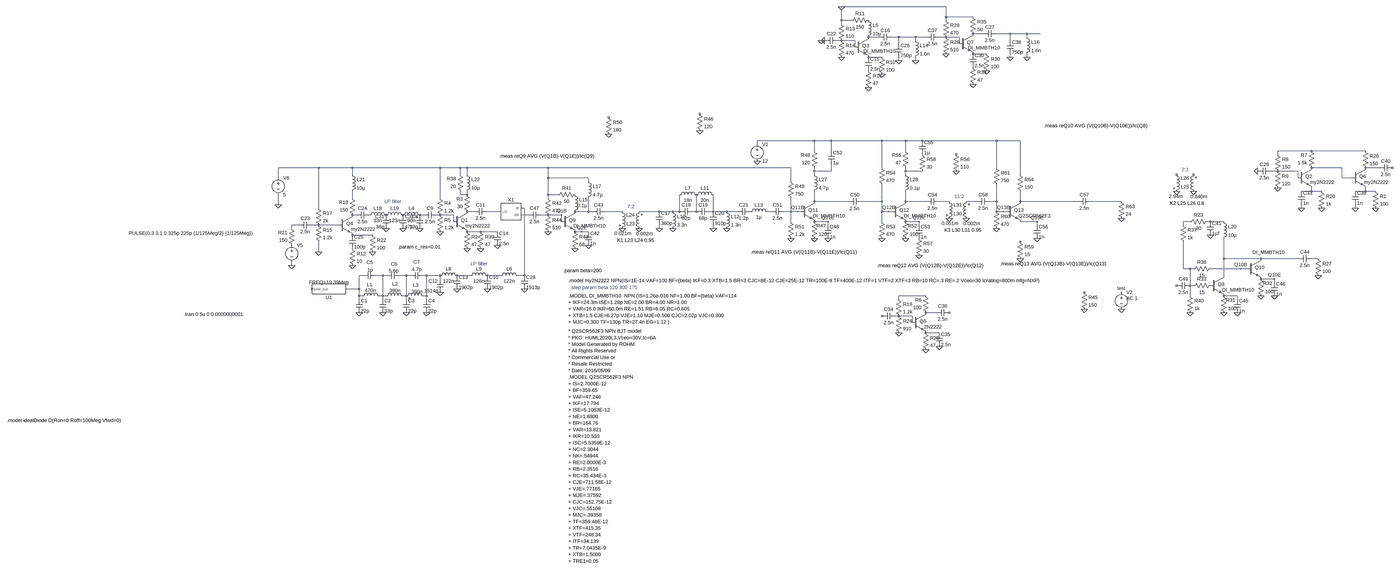
[diagram p0: schematic Draft1_old.asc, whole sheet]
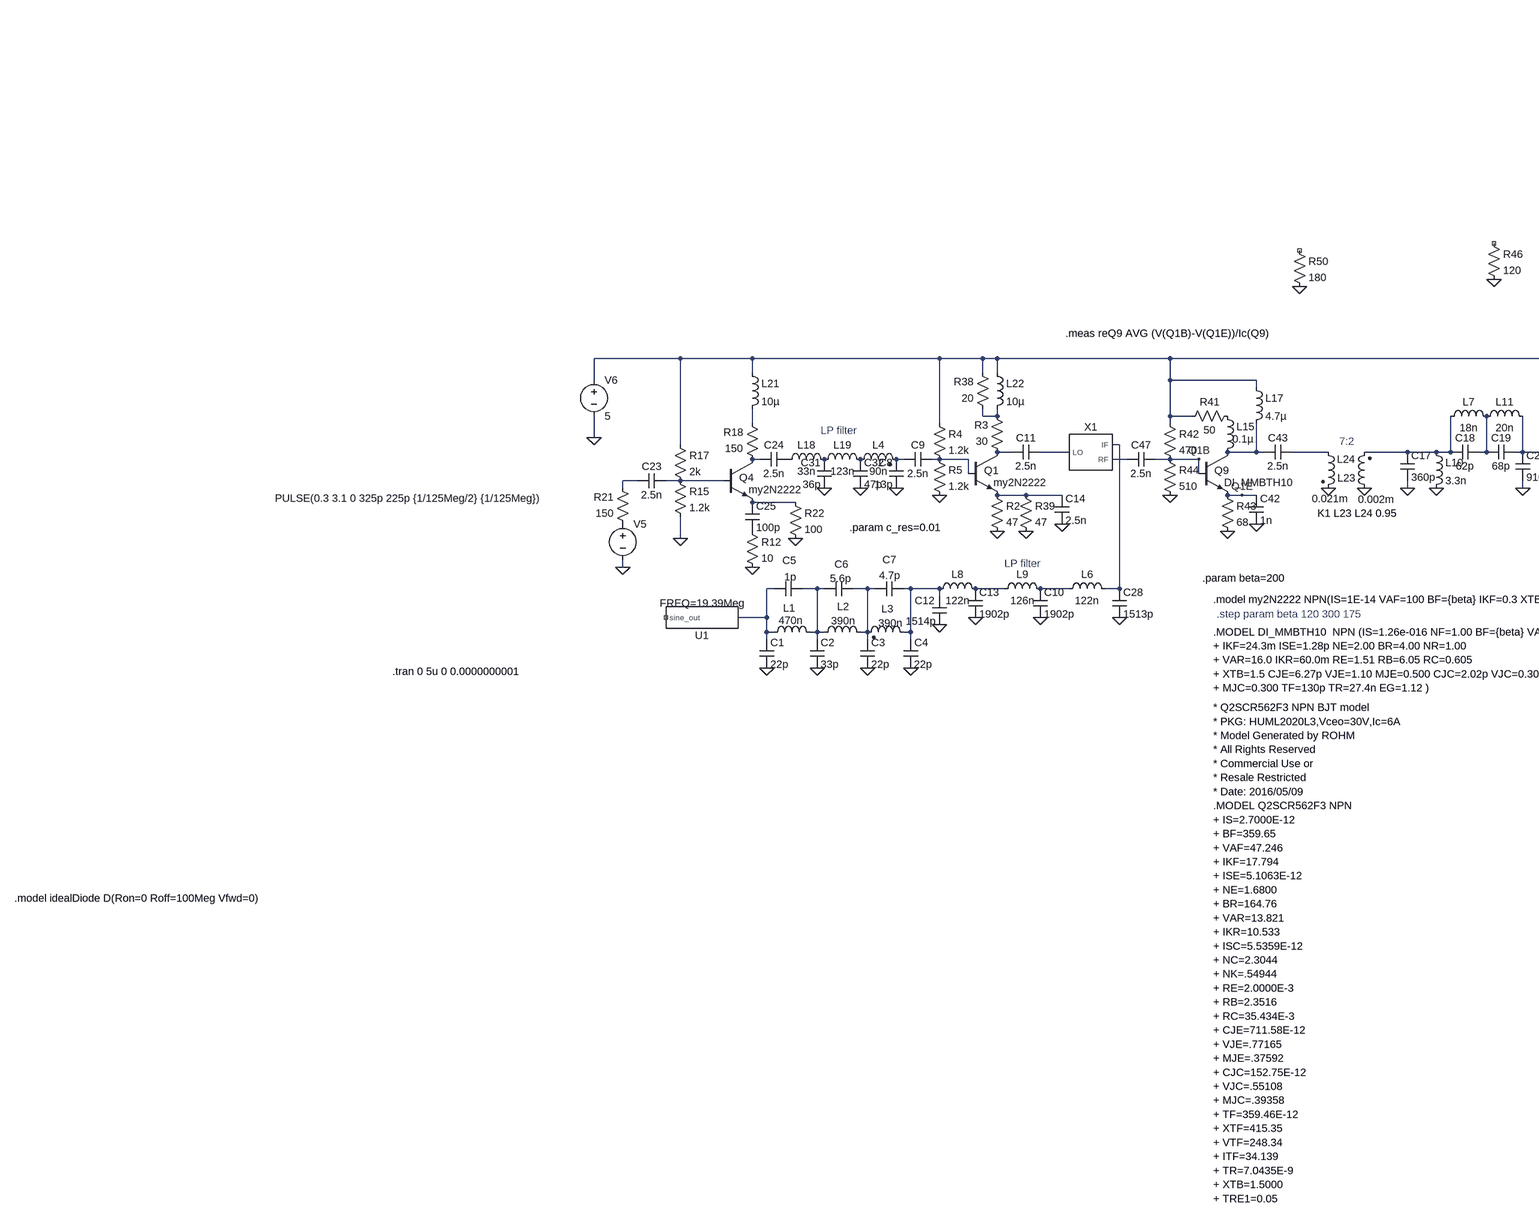
[diagram p1: schematic Draft1_old.asc, part, row 1 of 1, column 1 of 2]
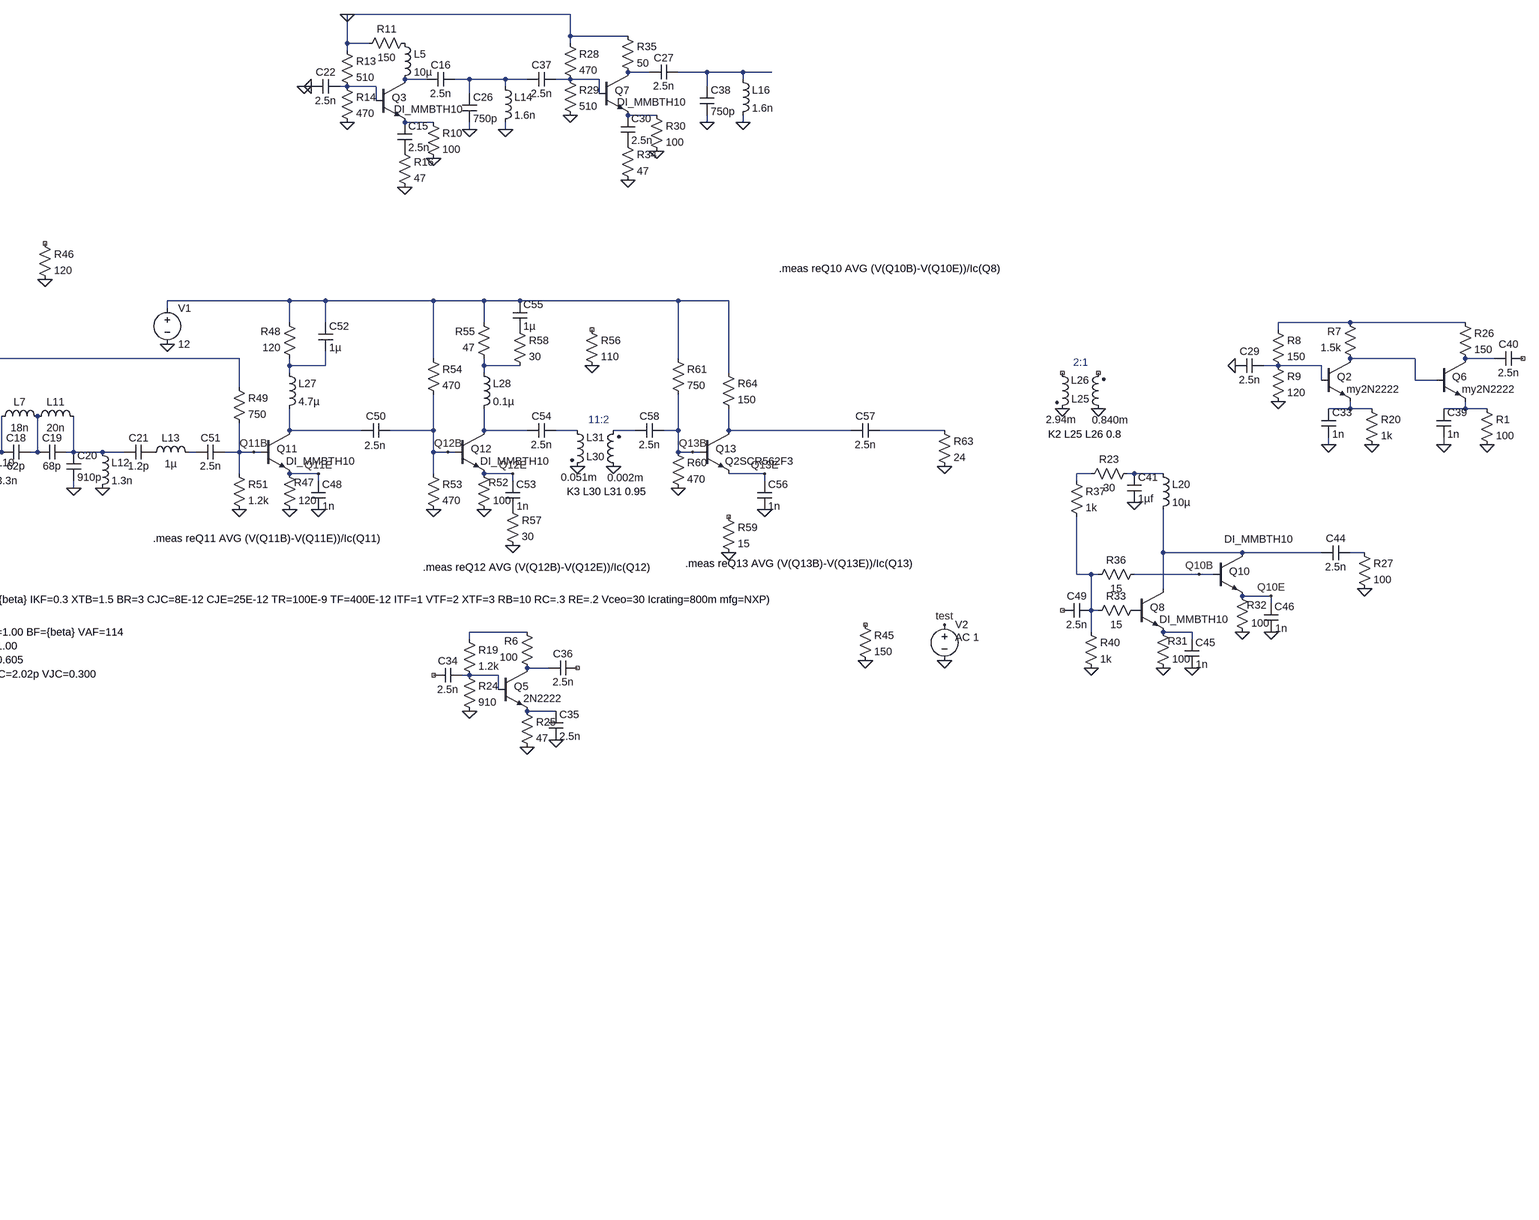
[diagram p2: schematic Draft1_old.asc, part, row 1 of 1, column 2 of 2]
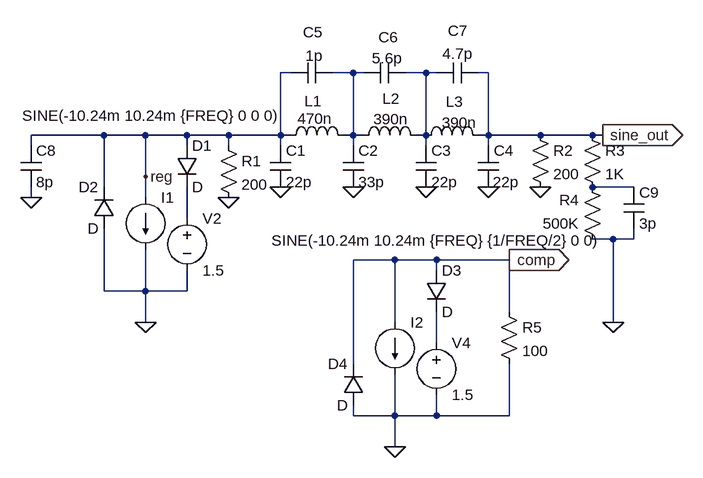
[diagram p3: sub-circuit ad9850.asc]
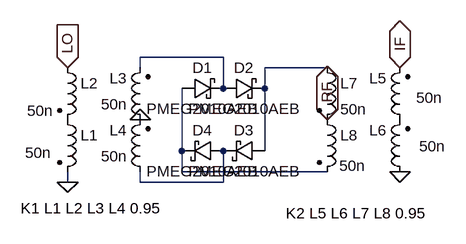
[diagram p4: sub-circuit mixer.asc]
Draft1_old.asc, the LTspice schematic file:
Version 4
SHEET 1 5384 1444
WIRE 3008 -1312 2512 -1312
WIRE 3008 -1264 3008 -1312
WIRE 3136 -1264 3008 -1264
WIRE 2512 -1248 2512 -1312
WIRE 2560 -1248 2512 -1248
WIRE 3008 -1248 3008 -1264
WIRE 2512 -1232 2512 -1248
WIRE 3184 -1184 3136 -1184
WIRE 3312 -1184 3248 -1184
WIRE 3392 -1184 3312 -1184
WIRE 3456 -1184 3392 -1184
WIRE 2688 -1168 2640 -1168
WIRE 2784 -1168 2752 -1168
WIRE 2864 -1168 2784 -1168
WIRE 2912 -1168 2864 -1168
WIRE 3008 -1168 2976 -1168
WIRE 3072 -1168 3008 -1168
WIRE 3392 -1168 3392 -1184
WIRE 2512 -1152 2496 -1152
WIRE 2576 -1152 2512 -1152
WIRE 2864 -1152 2864 -1168
WIRE 3312 -1152 3312 -1184
WIRE 2784 -1136 2784 -1168
WIRE 3072 -1136 3072 -1168
WIRE 2576 -1120 2576 -1152
WIRE 3200 -1088 3136 -1088
WIRE 2704 -1072 2640 -1072
WIRE 3312 -1072 3312 -1088
WIRE 3392 -1072 3392 -1088
WIRE 2784 -1056 2784 -1072
WIRE 2864 -1056 2864 -1072
WIRE 2384 -640 2112 -640
WIRE 2464 -640 2384 -640
WIRE 2704 -640 2464 -640
WIRE 2816 -640 2704 -640
WIRE 2896 -640 2816 -640
WIRE 3248 -640 2896 -640
WIRE 3360 -640 3248 -640
WIRE 2112 -624 2112 -640
WIRE 2384 -592 2384 -640
WIRE 2464 -592 2464 -640
WIRE 2816 -592 2816 -640
WIRE 4992 -592 4832 -592
WIRE 5248 -592 4992 -592
WIRE 4832 -576 4832 -592
WIRE 32 -512 -160 -512
WIRE 192 -512 32 -512
WIRE 608 -512 192 -512
WIRE 704 -512 608 -512
WIRE 736 -512 704 -512
WIRE 1120 -512 736 -512
WIRE 2272 -512 1120 -512
WIRE 2704 -512 2704 -640
WIRE 3248 -512 3248 -640
WIRE 5136 -512 4992 -512
WIRE 5312 -512 5248 -512
WIRE 2384 -496 2384 -512
WIRE 2464 -496 2464 -528
WIRE 2464 -496 2384 -496
WIRE 2816 -496 2816 -512
WIRE 2896 -496 2816 -496
WIRE 4832 -496 4800 -496
WIRE 4928 -496 4832 -496
WIRE 192 -480 192 -512
WIRE 704 -480 704 -512
WIRE 736 -480 736 -512
WIRE 2384 -480 2384 -496
WIRE 2816 -480 2816 -496
WIRE 3360 -480 3360 -640
WIRE -160 -464 -160 -512
WIRE 1120 -464 1120 -512
WIRE 1312 -464 1120 -464
WIRE 4928 -464 4928 -496
WIRE 5136 -464 5136 -512
WIRE 5184 -464 5136 -464
WIRE 1312 -448 1312 -464
WIRE 2272 -448 2272 -512
WIRE 4992 -400 4992 -416
WIRE 4992 -400 4944 -400
WIRE 5040 -400 4992 -400
WIRE 5248 -400 5248 -416
WIRE 5248 -400 5200 -400
WIRE 5296 -400 5248 -400
WIRE 704 -384 704 -400
WIRE 736 -384 736 -400
WIRE 736 -384 704 -384
WIRE 1120 -384 1120 -464
WIRE 1168 -384 1120 -384
WIRE 192 -368 192 -400
WIRE 608 -368 608 -512
WIRE 1120 -368 1120 -384
WIRE 2384 -352 2384 -400
WIRE 2544 -352 2384 -352
WIRE 2704 -352 2704 -432
WIRE 2704 -352 2608 -352
WIRE 2816 -352 2816 -400
WIRE 2912 -352 2816 -352
WIRE 3024 -352 2976 -352
WIRE 3152 -352 3104 -352
WIRE 3248 -352 3248 -432
WIRE 3248 -352 3216 -352
WIRE 3360 -352 3360 -400
WIRE 3632 -352 3360 -352
WIRE 3840 -352 3696 -352
WIRE -160 -336 -160 -384
WIRE 32 -320 32 -512
WIRE 1008 -320 992 -320
WIRE 4944 -320 4944 -336
WIRE 5200 -320 5200 -336
WIRE 768 -304 736 -304
WIRE 896 -304 832 -304
WIRE 1312 -304 1312 -368
WIRE 1312 -304 1248 -304
WIRE 1328 -304 1312 -304
WIRE 1472 -304 1392 -304
WIRE 1648 -304 1552 -304
WIRE 1712 -304 1648 -304
WIRE 1744 -304 1744 -384
WIRE 1744 -304 1712 -304
WIRE 1824 -304 1824 -384
WIRE 1824 -304 1808 -304
WIRE 1904 -304 1904 -384
WIRE 1904 -304 1888 -304
WIRE 1968 -304 1904 -304
WIRE 2016 -304 1968 -304
WIRE 2176 -304 2160 -304
WIRE 2272 -304 2272 -368
WIRE 2272 -304 2240 -304
WIRE 2304 -304 2272 -304
WIRE 2320 -304 2304 -304
WIRE 2704 -304 2704 -352
WIRE 2736 -304 2704 -304
WIRE 2752 -304 2736 -304
WIRE 3248 -304 3248 -352
WIRE 3280 -304 3248 -304
WIRE 3296 -304 3280 -304
WIRE 208 -288 192 -288
WIRE 528 -288 512 -288
WIRE 608 -288 592 -288
WIRE 672 -288 608 -288
WIRE 1024 -288 992 -288
WIRE 1120 -288 1088 -288
WIRE 1184 -288 1120 -288
WIRE 672 -256 672 -288
WIRE 1184 -256 1184 -288
WIRE 2272 -256 2272 -304
WIRE 2448 -256 2384 -256
WIRE 2704 -256 2704 -304
WIRE 2880 -256 2816 -256
WIRE 3440 -256 3360 -256
WIRE 4416 -256 4384 -256
WIRE 4512 -256 4496 -256
WIRE 4576 -256 4512 -256
WIRE -64 -240 -96 -240
WIRE 32 -240 0 -240
WIRE 128 -240 32 -240
WIRE 2448 -240 2448 -256
WIRE 2880 -240 2880 -256
WIRE 3440 -240 3440 -256
WIRE 4384 -240 4384 -256
WIRE -96 -224 -96 -240
WIRE 1648 -224 1648 -240
WIRE 1904 -224 1904 -240
WIRE 800 -208 736 -208
WIRE 880 -208 800 -208
WIRE 1280 -208 1248 -208
WIRE 1312 -208 1280 -208
WIRE 288 -192 192 -192
WIRE 32 -112 32 -160
WIRE 4576 -80 4576 -176
WIRE 4752 -80 4576 -80
WIRE 4928 -80 4752 -80
WIRE 5024 -80 4992 -80
WIRE -96 -48 -96 -64
WIRE 4384 -32 4384 -160
WIRE 4416 -32 4384 -32
WIRE 4432 -32 4416 -32
WIRE 4656 -32 4512 -32
WIRE 4688 -32 4656 -32
WIRE 240 0 224 0
WIRE 336 0 304 0
WIRE 352 0 336 0
WIRE 448 0 416 0
WIRE 464 0 448 0
WIRE 544 0 528 0
WIRE 608 0 544 0
WIRE 752 0 688 0
WIRE 896 0 832 0
WIRE 1008 0 1008 -320
WIRE 1008 0 976 0
WIRE 4576 0 4576 -80
WIRE 608 16 608 0
WIRE 4816 16 4752 16
WIRE 4816 32 4816 16
WIRE 4416 48 4416 -32
WIRE 4432 48 4416 48
WIRE 224 64 224 0
WIRE 224 64 160 64
WIRE 224 96 224 64
WIRE 240 96 224 96
WIRE 336 96 336 0
WIRE 336 96 320 96
WIRE 352 96 336 96
WIRE 448 96 448 0
WIRE 448 96 432 96
WIRE 544 96 544 0
WIRE 544 96 528 96
WIRE 2912 96 2784 96
WIRE 4416 96 4416 48
WIRE 4640 96 4576 96
WIRE 224 112 224 96
WIRE 336 112 336 96
WIRE 448 112 448 96
WIRE 544 112 544 96
WIRE 2784 112 2784 96
WIRE 4640 112 4640 96
WIRE 2960 176 2912 176
WIRE 2784 192 2768 192
WIRE 2848 192 2784 192
WIRE 2848 224 2848 192
WIRE 2976 272 2912 272
FLAG 224 176 0
FLAG 336 176 0
FLAG 448 176 0
FLAG 544 176 0
FLAG 688 64 0
FLAG 832 64 0
FLAG -96 -48 0
FLAG -160 -336 0
FLAG 32 -112 0
FLAG 192 -48 0
FLAG 288 -112 0
FLAG 352 -224 0
FLAG 432 -224 0
FLAG 1008 64 0
FLAG 608 80 0
FLAG 512 -224 0
FLAG 608 -208 0
FLAG 4832 -416 0
FLAG 5040 -320 0
FLAG 4944 -320 0
FLAG 2784 272 0
FLAG 2912 352 0
FLAG 2976 336 0
FLAG 5296 -320 0
FLAG 5200 -320 0
FLAG 2512 -1072 0
FLAG 1648 -224 0
FLAG 1712 -224 0
FLAG 1904 -224 0
FLAG 1968 -224 0
FLAG 2704 -992 0
FLAG 2640 -928 0
FLAG 2864 -1056 0
FLAG 2784 -1056 0
FLAG 3008 -1088 0
FLAG 3200 -1008 0
FLAG 3136 -944 0
FLAG 3392 -1072 0
FLAG 3312 -1072 0
FLAG 736 -128 0
FLAG 880 -144 0
FLAG 800 -128 0
FLAG 1248 -128 0
FLAG 1120 -208 0
FLAG 1312 -144 0
FLAG 1184 -288 Q1B
FLAG 1280 -208 Q1E
FLAG 1472 -224 0
FLAG 1552 -224 0
FLAG 2112 -544 0
FLAG 4512 -192 0
FLAG 5024 0 0
FLAG 4640 176 0
FLAG 4576 176 0
FLAG 4816 96 0
FLAG 4752 96 0
FLAG 4416 176 0
FLAG 4656 -32 Q10B
FLAG 4816 16 Q10E
FLAG 4352 -400 0
FLAG 4432 -400 0
FLAG 1840 -688 0
FLAG 2448 -176 0
FLAG 2384 -176 0
FLAG 2272 -176 0
FLAG 2304 -304 Q11B
FLAG 2448 -256 Q11E
FLAG 4736 -496 0
FLAG 2416 -1152 0
FLAG 2432 -1152 0
FLAG 2512 -1312 0
FLAG 1408 -672 0
FLAG 3664 160 0
FLAG 2816 -176 0
FLAG 2704 -176 0
FLAG 2736 -304 Q12B
FLAG 2880 -256 Q12E
FLAG 3056 -496 0
FLAG 2880 -96 0
FLAG 3840 160 0
FLAG 3840 80 test
FLAG 3840 -272 0
FLAG 3024 -272 0
FLAG 3104 -272 0
FLAG 3360 -80 0
FLAG 3440 -176 0
FLAG 3248 -224 0
FLAG 3280 -304 Q13B
FLAG 3440 -256 Q13E
SYMBOL AD9850 80 64 R180
WINDOW 39 -95 32 Left 2
SYMATTR SpiceLine FREQ=19.39Meg
SYMATTR InstName U1
SYMBOL cap 208 112 R0
SYMATTR InstName C1
SYMATTR Value 22p
SYMBOL cap 320 112 R0
SYMATTR InstName C2
SYMATTR Value 33p
SYMBOL cap 432 112 R0
SYMATTR InstName C3
SYMATTR Value 22p
SYMBOL cap 528 112 R0
WINDOW 3 23 56 Left 2
SYMATTR Value 22p
SYMATTR InstName C4
SYMBOL ind 336 112 M270
WINDOW 0 53 62 VTop 2
WINDOW 3 57 59 VBottom 2
SYMATTR InstName L1
SYMATTR Value 470n
SYMBOL ind 448 112 M270
WINDOW 0 57 54 VTop 2
WINDOW 3 56 54 VBottom 2
SYMATTR InstName L2
SYMATTR Value 390n
SYMBOL ind2 544 112 M270
WINDOW 0 52 52 VTop 2
WINDOW 3 51 45 VBottom 2
SYMATTR InstName L3
SYMATTR Value 390n
SYMATTR Type ind
SYMBOL cap 304 -16 R90
WINDOW 0 -31 30 VBottom 2
WINDOW 3 -26 28 VTop 2
SYMATTR InstName C5
SYMATTR Value 1p
SYMBOL cap 416 -16 R90
WINDOW 0 -23 26 VBottom 2
WINDOW 3 -22 28 VTop 2
SYMATTR InstName C6
SYMATTR Value 5.6p
SYMBOL cap 528 -16 R90
WINDOW 0 -33 31 VBottom 2
WINDOW 3 -29 31 VTop 2
SYMATTR InstName C7
SYMATTR Value 4.7p
SYMBOL ind 592 16 R270
WINDOW 0 32 56 VTop 2
WINDOW 3 5 56 VBottom 2
SYMATTR InstName L8
SYMATTR Value 122n
SYMBOL cap 624 80 R180
WINDOW 0 27 54 Left 2
WINDOW 3 24 8 Left 2
SYMATTR InstName C12
SYMATTR Value 1514p
SYMBOL ind 736 16 R270
WINDOW 0 32 56 VTop 2
WINDOW 3 5 56 VBottom 2
SYMATTR InstName L9
SYMATTR Value 126n
SYMBOL cap 672 0 R0
SYMATTR InstName C13
SYMATTR Value 1902p
SYMBOL voltage -96 -160 R0
WINDOW 123 0 0 Left 0
WINDOW 39 0 0 Left 0
WINDOW 3 -773 -41 Left 2
SYMATTR Value PULSE(0.3 3.1 0 325p 225p {1/125Meg/2} {1/125Meg})
SYMATTR InstName V5
SYMBOL npn 128 -288 R0
WINDOW 0 35 41 Left 2
SYMATTR InstName Q4
SYMATTR Value my2N2222
SYMBOL res 208 -272 R180
WINDOW 0 36 76 Left 2
WINDOW 3 36 40 Left 2
SYMATTR InstName R18
SYMATTR Value 150
SYMBOL voltage -160 -480 R0
WINDOW 123 0 0 Left 0
WINDOW 39 0 0 Left 0
SYMATTR InstName V6
SYMATTR Value 5
SYMBOL cap 0 -256 R90
WINDOW 0 0 32 VBottom 2
WINDOW 3 32 32 VTop 2
SYMATTR InstName C23
SYMATTR Value 2.5n
SYMBOL res 16 -256 R0
SYMATTR InstName R15
SYMATTR Value 1.2k
SYMBOL res 16 -336 R0
SYMATTR InstName R17
SYMATTR Value 2k
SYMBOL cap 176 -192 R0
SYMATTR InstName C25
SYMATTR Value 100p
SYMBOL res 176 -144 R0
SYMATTR InstName R12
SYMATTR Value 10
SYMBOL res -80 -128 R180
WINDOW 0 36 76 Left 2
WINDOW 3 36 40 Left 2
SYMATTR InstName R21
SYMATTR Value 150
SYMBOL cap 272 -304 R90
WINDOW 0 0 32 VBottom 2
WINDOW 3 32 32 VTop 2
SYMATTR InstName C24
SYMATTR Value 2.5n
SYMATTR SpiceLine Rser={C_RES}
SYMBOL res 272 -208 R0
SYMATTR InstName R22
SYMATTR Value 100
SYMBOL ind 256 -272 R270
WINDOW 0 32 56 VTop 2
WINDOW 3 5 56 VBottom 2
SYMATTR InstName L18
SYMATTR Value 33n
SYMBOL ind 336 -272 R270
WINDOW 0 32 56 VTop 2
WINDOW 3 5 56 VBottom 2
SYMATTR InstName L19
SYMATTR Value 123n
SYMBOL cap 368 -224 R180
WINDOW 0 24 56 Left 2
WINDOW 3 24 8 Left 2
SYMATTR InstName C31
SYMATTR Value 36p
SYMATTR SpiceLine Rser={C_RES}
SYMBOL cap 416 -288 R0
SYMATTR InstName C32
SYMATTR Value 47p
SYMATTR SpiceLine Rser={C_RES}
SYMBOL ind 880 16 R270
WINDOW 0 32 56 VTop 2
WINDOW 3 5 56 VBottom 2
SYMATTR InstName L6
SYMATTR Value 122n
SYMBOL cap 816 0 R0
SYMATTR InstName C10
SYMATTR Value 1902p
SYMBOL cap 992 0 R0
SYMATTR InstName C28
SYMATTR Value 1513p
SYMBOL mixer 944 -304 R0
SYMATTR InstName X1
SYMBOL ind2 416 -272 R270
WINDOW 0 32 56 VTop 2
WINDOW 3 5 56 VBottom 2
SYMATTR InstName L4
SYMATTR Value 90n
SYMATTR Type ind
SYMBOL cap 528 -224 R180
WINDOW 0 24 56 Left 2
WINDOW 3 24 8 Left 2
SYMATTR InstName C8
SYMATTR Value 13p
SYMATTR SpiceLine Rser={C_RES}
SYMBOL npn 672 -304 R0
WINDOW 0 35 41 Left 2
SYMATTR InstName Q1
SYMATTR Value my2N2222
SYMBOL cap 592 -304 R90
WINDOW 0 0 32 VBottom 2
WINDOW 3 32 32 VTop 2
SYMATTR InstName C9
SYMATTR Value 2.5n
SYMATTR SpiceLine Rser={C_RES}
SYMBOL res 752 -288 R180
WINDOW 0 36 76 Left 2
WINDOW 3 36 40 Left 2
SYMATTR InstName R3
SYMATTR Value 30
SYMBOL res 592 -384 R0
SYMATTR InstName R4
SYMATTR Value 1.2k
SYMBOL res 592 -304 R0
SYMATTR InstName R5
SYMATTR Value 1.2k
SYMBOL res 720 -224 R0
SYMATTR InstName R2
SYMATTR Value 47
SYMBOL npn 4928 -512 R0
WINDOW 0 35 41 Left 2
SYMATTR InstName Q2
SYMATTR Value my2N2222
SYMBOL res 5008 -496 R180
WINDOW 0 36 76 Left 2
WINDOW 3 36 40 Left 2
SYMATTR InstName R7
SYMATTR Value 1.5k
SYMBOL res 4816 -592 R0
SYMATTR InstName R8
SYMATTR Value 150
SYMBOL res 4816 -512 R0
SYMATTR InstName R9
SYMATTR Value 120
SYMBOL cap 864 -208 R0
SYMATTR InstName C14
SYMATTR Value 2.5n
SYMBOL cap 832 -320 R90
WINDOW 0 0 32 VBottom 2
WINDOW 3 32 32 VTop 2
SYMATTR InstName C11
SYMATTR Value 2.5n
SYMBOL cap 4800 -512 R90
WINDOW 0 0 32 VBottom 2
WINDOW 3 32 32 VTop 2
SYMATTR InstName C29
SYMATTR Value 2.5n
SYMBOL cap 4928 -400 R0
SYMATTR InstName C33
SYMATTR Value 1n
SYMBOL res 5024 -416 R0
SYMATTR InstName R20
SYMATTR Value 1k
SYMBOL npn 2848 176 R0
WINDOW 0 35 41 Left 2
SYMATTR InstName Q5
SYMATTR Value 2N2222
SYMBOL cap 2768 176 R90
WINDOW 0 0 32 VBottom 2
WINDOW 3 32 32 VTop 2
SYMATTR InstName C34
SYMATTR Value 2.5n
SYMBOL res 2928 192 R180
WINDOW 0 36 76 Left 2
WINDOW 3 36 40 Left 2
SYMATTR InstName R6
SYMATTR Value 100
SYMBOL res 2768 96 R0
SYMATTR InstName R19
SYMATTR Value 1.2k
SYMBOL res 2768 176 R0
SYMATTR InstName R24
SYMATTR Value 910
SYMBOL res 2896 256 R0
SYMATTR InstName R25
SYMATTR Value 47
SYMBOL cap 2960 272 R0
SYMATTR InstName C35
SYMATTR Value 2.5n
SYMBOL cap 3024 160 R90
WINDOW 0 0 32 VBottom 2
WINDOW 3 32 32 VTop 2
SYMATTR InstName C36
SYMATTR Value 2.5n
SYMBOL npn 5184 -512 R0
WINDOW 0 35 41 Left 2
SYMATTR InstName Q6
SYMATTR Value my2N2222
SYMBOL cap 5184 -400 R0
SYMATTR InstName C39
SYMATTR Value 1n
SYMBOL res 5280 -416 R0
SYMATTR InstName R1
SYMATTR Value 100
SYMBOL res 5232 -608 R0
SYMATTR InstName R26
SYMATTR Value 150
SYMBOL cap 5376 -528 R90
WINDOW 0 0 32 VBottom 2
WINDOW 3 32 32 VTop 2
SYMATTR InstName C40
SYMATTR Value 2.5n
SYMBOL ind 176 -496 R0
SYMATTR InstName L21
SYMATTR Value 10µ
SYMBOL ind 720 -496 R0
SYMATTR InstName L22
SYMATTR Value 10µ
SYMBOL npn 2576 -1168 R0
WINDOW 0 35 41 Left 2
WINDOW 3 40 67 Left 2
SYMATTR InstName Q3
SYMATTR Value DI_MMBTH10
SYMBOL res 2544 -1232 R270
WINDOW 0 32 56 VTop 2
WINDOW 3 0 56 VBottom 2
SYMATTR InstName R11
SYMATTR Value 150
SYMBOL res 2496 -1248 R0
SYMATTR InstName R13
SYMATTR Value 510
SYMBOL res 2496 -1168 R0
SYMATTR InstName R14
SYMATTR Value 470
SYMBOL cap 2752 -1184 R90
WINDOW 0 0 32 VBottom 2
WINDOW 3 32 32 VTop 2
SYMATTR InstName C16
SYMATTR Value 2.5n
SYMBOL ind 2624 -1264 R0
SYMATTR InstName L5
SYMATTR Value 10µ
SYMBOL cap 1632 -304 R0
SYMATTR InstName C17
SYMATTR Value 360p
SYMBOL cap 1808 -320 R90
WINDOW 0 0 32 VBottom 2
WINDOW 3 32 32 VTop 2
SYMATTR InstName C18
SYMATTR Value 62p
SYMBOL ind 1728 -368 R270
WINDOW 0 32 56 VTop 2
WINDOW 3 5 56 VBottom 2
SYMATTR InstName L7
SYMATTR Value 18n
SYMBOL ind 1696 -320 R0
SYMATTR InstName L10
SYMATTR Value 3.3n
SYMBOL cap 1888 -320 R90
WINDOW 0 0 32 VBottom 2
WINDOW 3 32 32 VTop 2
SYMATTR InstName C19
SYMATTR Value 68p
SYMBOL ind 1808 -368 R270
WINDOW 0 32 56 VTop 2
WINDOW 3 5 56 VBottom 2
SYMATTR InstName L11
SYMATTR Value 20n
SYMBOL cap 1888 -304 R0
SYMATTR InstName C20
SYMATTR Value 910p
SYMBOL ind 1952 -320 R0
SYMATTR InstName L12
SYMATTR Value 1.3n
SYMBOL cap 2080 -320 R90
WINDOW 0 0 32 VBottom 2
WINDOW 3 32 32 VTop 2
SYMATTR InstName C21
SYMATTR Value 1.2p
SYMBOL ind 2064 -288 R270
WINDOW 0 32 56 VTop 2
WINDOW 3 5 56 VBottom 2
SYMATTR InstName L13
SYMATTR Value 1µ
SYMBOL cap 2496 -1168 R90
WINDOW 0 0 32 VBottom 2
WINDOW 3 32 32 VTop 2
SYMATTR InstName C22
SYMATTR Value 2.5n
SYMBOL cap 2624 -1072 R0
SYMATTR InstName C15
SYMATTR Value 2.5n
SYMBOL res 2688 -1088 R0
SYMATTR InstName R10
SYMATTR Value 100
SYMBOL res 2624 -1024 R0
SYMATTR InstName R16
SYMATTR Value 47
SYMBOL cap 2768 -1136 R0
SYMATTR InstName C26
SYMATTR Value 750p
SYMBOL ind 2848 -1168 R0
SYMATTR InstName L14
SYMATTR Value 1.6n
SYMBOL npn 3072 -1184 R0
WINDOW 0 35 41 Left 2
WINDOW 3 40 67 Left 2
SYMATTR InstName Q7
SYMATTR Value DI_MMBTH10
SYMBOL res 2992 -1264 R0
SYMATTR InstName R28
SYMATTR Value 470
SYMBOL res 2992 -1184 R0
SYMATTR InstName R29
SYMATTR Value 510
SYMBOL cap 3248 -1200 R90
WINDOW 0 0 32 VBottom 2
WINDOW 3 32 32 VTop 2
SYMATTR InstName C27
SYMATTR Value 2.5n
SYMBOL cap 3120 -1088 R0
SYMATTR InstName C30
SYMATTR Value 2.5n
SYMBOL res 3184 -1104 R0
SYMATTR InstName R30
SYMATTR Value 100
SYMBOL res 3120 -1040 R0
SYMATTR InstName R34
SYMATTR Value 47
SYMBOL cap 2976 -1184 R90
WINDOW 0 0 32 VBottom 2
WINDOW 3 32 32 VTop 2
SYMATTR InstName C37
SYMATTR Value 2.5n
SYMBOL cap 3296 -1152 R0
SYMATTR InstName C38
SYMATTR Value 750p
SYMBOL ind 3376 -1184 R0
SYMATTR InstName L16
SYMATTR Value 1.6n
SYMBOL res 3120 -1280 R0
SYMATTR InstName R35
SYMATTR Value 50
SYMBOL res 720 -384 R180
WINDOW 0 36 76 Left 2
WINDOW 3 36 40 Left 2
SYMATTR InstName R38
SYMATTR Value 20
SYMBOL res 784 -224 R0
SYMATTR InstName R39
SYMATTR Value 47
SYMBOL npn 1184 -304 R0
WINDOW 0 35 41 Left 2
SYMATTR InstName Q9
SYMATTR Value DI_MMBTH10
SYMBOL res 1152 -368 R270
WINDOW 0 32 56 VTop 2
WINDOW 3 0 56 VBottom 2
SYMATTR InstName R41
SYMATTR Value 50
SYMBOL res 1104 -384 R0
SYMATTR InstName R42
SYMATTR Value 470
SYMBOL res 1232 -224 R0
SYMATTR InstName R43
SYMATTR Value 68
SYMBOL cap 1296 -208 R0
SYMATTR InstName C42
SYMATTR Value 1n
SYMBOL cap 1392 -320 R90
WINDOW 0 0 32 VBottom 2
WINDOW 3 32 32 VTop 2
SYMATTR InstName C43
SYMATTR Value 2.5n
SYMBOL cap 1088 -304 R90
WINDOW 0 0 32 VBottom 2
WINDOW 3 32 32 VTop 2
SYMATTR InstName C47
SYMATTR Value 2.5n
SYMBOL ind 1232 -400 R0
WINDOW 3 27 67 Left 2
SYMATTR Value 0.1µ
SYMATTR InstName L15
SYMBOL res 1104 -304 R0
SYMATTR InstName R44
SYMATTR Value 510
SYMBOL ind 1296 -464 R0
SYMATTR InstName L17
SYMATTR Value 4.7µ
SYMBOL ind2 1456 -320 R0
WINDOW 0 36 74 Left 2
WINDOW 3 -21 120 Left 2
SYMATTR InstName L23
SYMATTR Value 0.021m
SYMATTR Type ind
SYMBOL ind2 1568 -208 R180
WINDOW 0 36 80 Left 2
WINDOW 3 -51 -9 Left 2
SYMATTR InstName L24
SYMATTR Value 0.002m
SYMATTR Type ind
SYMBOL cap 4416 32 R90
WINDOW 0 0 32 VBottom 2
WINDOW 3 32 32 VTop 2
SYMATTR InstName C49
SYMATTR Value 2.5n
SYMBOL voltage 2112 -640 R0
WINDOW 123 0 0 Left 0
WINDOW 39 0 0 Left 0
SYMATTR InstName V1
SYMATTR Value 12
SYMBOL res 1392 -768 R0
SYMATTR InstName R50
SYMATTR Value 180
SYMBOL npn 4512 0 R0
WINDOW 0 35 41 Left 2
SYMATTR InstName Q8
SYMATTR Value DI_MMBTH10
SYMBOL ind 4560 -272 R0
SYMATTR InstName L20
SYMATTR Value 10µ
SYMBOL res 4400 -240 R270
WINDOW 0 32 56 VTop 2
WINDOW 3 0 56 VBottom 2
SYMATTR InstName R23
SYMATTR Value 30
SYMBOL cap 4496 -256 R0
SYMATTR InstName C41
SYMATTR Value 1µf
SYMBOL cap 4992 -96 R90
WINDOW 0 0 32 VBottom 2
WINDOW 3 32 32 VTop 2
SYMATTR InstName C44
SYMATTR Value 2.5n
SYMBOL res 5008 -96 R0
SYMATTR InstName R27
SYMATTR Value 100
SYMBOL res 4560 80 R0
WINDOW 0 26 36 Left 2
SYMATTR InstName R31
SYMATTR Value 100
SYMBOL cap 4624 112 R0
WINDOW 3 25 56 Left 2
SYMATTR Value 1n
SYMATTR InstName C45
SYMBOL npn 4688 -80 R0
WINDOW 0 35 41 Left 2
WINDOW 3 24 -30 Left 2
SYMATTR InstName Q10
SYMATTR Value DI_MMBTH10
SYMBOL res 4736 0 R0
WINDOW 0 26 36 Left 2
SYMATTR InstName R32
SYMATTR Value 100
SYMBOL cap 4800 32 R0
WINDOW 3 25 56 Left 2
SYMATTR Value 1n
SYMATTR InstName C46
SYMBOL res 4528 32 R90
WINDOW 0 0 56 VBottom 2
WINDOW 3 32 56 VTop 2
SYMATTR InstName R33
SYMATTR Value 15
SYMBOL res 4416 -16 R270
WINDOW 0 32 56 VTop 2
WINDOW 3 0 56 VBottom 2
SYMATTR InstName R36
SYMATTR Value 15
SYMBOL res 4368 -256 R0
SYMATTR InstName R37
SYMATTR Value 1k
SYMBOL res 4400 80 R0
SYMATTR InstName R40
SYMATTR Value 1k
SYMBOL ind2 4336 -496 R0
WINDOW 0 36 74 Left 2
WINDOW 3 -21 120 Left 2
SYMATTR InstName L25
SYMATTR Value 2.94m
SYMATTR Type ind
SYMBOL ind2 4448 -384 R180
WINDOW 0 36 80 Left 2
WINDOW 3 -51 -9 Left 2
SYMATTR InstName L26
SYMATTR Value 0.840m
SYMATTR Type ind
SYMBOL res 1824 -784 R0
SYMATTR InstName R46
SYMATTR Value 120
SYMBOL npn 2320 -352 R0
WINDOW 0 35 41 Left 2
SYMATTR InstName Q11
SYMATTR Value DI_MMBTH10
SYMBOL res 2368 -272 R0
WINDOW 0 26 36 Left 2
SYMATTR InstName R47
SYMATTR Value 120
SYMBOL cap 2432 -240 R0
WINDOW 3 25 56 Left 2
SYMATTR Value 1n
SYMATTR InstName C48
SYMBOL res 2256 -272 R0
SYMATTR InstName R51
SYMATTR Value 1.2k
SYMBOL res 2256 -464 R0
SYMATTR InstName R49
SYMATTR Value 750
SYMBOL ind 2368 -496 R0
SYMATTR InstName L27
SYMATTR Value 4.7µ
SYMBOL res 2400 -496 R180
WINDOW 0 36 76 Left 2
WINDOW 3 36 40 Left 2
SYMATTR InstName R48
SYMATTR Value 120
SYMBOL cap 2608 -368 R90
WINDOW 0 0 32 VBottom 2
WINDOW 3 34 34 VTop 2
SYMATTR InstName C50
SYMATTR Value 2.5n
SYMBOL cap 2240 -320 R90
WINDOW 0 0 32 VBottom 2
WINDOW 3 32 32 VTop 2
SYMATTR InstName C51
SYMATTR Value 2.5n
SYMBOL cap 2448 -592 R0
SYMATTR InstName C52
SYMATTR Value 1µ
SYMBOL res 3648 64 R0
SYMATTR InstName R45
SYMATTR Value 150
SYMBOL npn 2752 -352 R0
WINDOW 0 35 41 Left 2
SYMATTR InstName Q12
SYMATTR Value DI_MMBTH10
SYMBOL res 2800 -272 R0
WINDOW 0 26 36 Left 2
SYMATTR InstName R52
SYMATTR Value 100
SYMBOL cap 2864 -240 R0
WINDOW 3 25 56 Left 2
SYMATTR Value 1n
SYMATTR InstName C53
SYMBOL res 2688 -272 R0
SYMATTR InstName R53
SYMATTR Value 470
SYMBOL res 2688 -528 R0
SYMATTR InstName R54
SYMATTR Value 470
SYMBOL ind 2800 -496 R0
SYMATTR InstName L28
SYMATTR Value 0.1µ
SYMBOL res 2832 -496 R180
WINDOW 0 36 76 Left 2
WINDOW 3 36 40 Left 2
SYMATTR InstName R55
SYMATTR Value 47
SYMBOL cap 2976 -368 R90
WINDOW 0 0 32 VBottom 2
WINDOW 3 32 32 VTop 2
SYMATTR InstName C54
SYMATTR Value 2.5n
SYMBOL cap 2880 -640 R0
SYMATTR InstName C55
SYMATTR Value 1µ
SYMBOL res 3040 -592 R0
SYMATTR InstName R56
SYMATTR Value 110
SYMBOL res 2864 -192 R0
SYMATTR InstName R57
SYMATTR Value 30
SYMBOL res 2880 -592 R0
SYMATTR InstName R58
SYMATTR Value 30
SYMBOL voltage 3840 64 R0
WINDOW 123 24 44 Left 2
WINDOW 39 0 0 Left 0
SYMATTR Value2 AC 1
SYMATTR InstName V2
SYMATTR Value ""
SYMBOL npn 3296 -352 R0
WINDOW 0 35 41 Left 2
SYMATTR InstName Q13
SYMATTR Value Q2SCR562F3
SYMBOL res 3232 -528 R0
SYMATTR InstName R61
SYMATTR Value 750
SYMBOL cap 3696 -368 R90
WINDOW 0 0 32 VBottom 2
WINDOW 3 32 32 VTop 2
SYMATTR InstName C57
SYMATTR Value 2.5n
SYMBOL res 3824 -368 R0
SYMATTR InstName R63
SYMATTR Value 24
SYMBOL ind2 3008 -368 R0
WINDOW 0 36 74 Left 2
WINDOW 3 -21 120 Left 2
SYMATTR InstName L30
SYMATTR Value 0.051m
SYMATTR Type ind
SYMBOL ind2 3120 -256 R180
WINDOW 0 36 80 Left 2
WINDOW 3 -51 -9 Left 2
SYMATTR InstName L31
SYMATTR Value 0.002m
SYMATTR Type ind
SYMBOL res 3344 -176 R0
SYMATTR InstName R59
SYMATTR Value 15
SYMBOL cap 3424 -240 R0
SYMATTR InstName C56
SYMATTR Value 1n
SYMBOL res 3344 -496 R0
SYMATTR InstName R64
SYMATTR Value 150
SYMBOL cap 3216 -368 R90
WINDOW 0 0 32 VBottom 2
WINDOW 3 32 32 VTop 2
SYMATTR InstName C58
SYMATTR Value 2.5n
SYMBOL res 3232 -320 R0
SYMATTR InstName R60
SYMATTR Value 470
TEXT -608 184 Left 2 !.tran 0 5u 0 0.0000000001
TEXT 752 -56 Left 2 ;LP filter
TEXT -1448 688 Left 2 !.model idealDiode D(Ron=0 Roff=100Meg Vfwd=0)
TEXT 408 -136 Left 2 !.param c_res=0.01
TEXT 344 -352 Left 2 ;LP filter
TEXT 1216 24 Left 2 !.model my2N2222 NPN(IS=1E-14 VAF=100 BF={beta} IKF=0.3 XTB=1.5 BR=3 CJC=8E-12 CJE=25E-12 TR=100E-9 TF=400E-12 ITF=1 VTF=2 XTF=3 RB=10 RC=.3 RE=.2 Vceo=30 Icrating=800m mfg=NXP)
TEXT 1224 56 Left 2 ;.step param beta 120 300 175
TEXT 1216 96 Left 2 !.MODEL DI_MMBTH10  NPN (IS=1.26e-016 NF=1.00 BF={beta} VAF=114\n+ IKF=24.3m ISE=1.28p NE=2.00 BR=4.00 NR=1.00\n+ VAR=16.0 IKR=60.0m RE=1.51 RB=6.05 RC=0.605\n+ XTB=1.5 CJE=6.27p VJE=1.10 MJE=0.500 CJC=2.02p VJC=0.300\n+ MJC=0.300 TF=130p TR=27.4n EG=1.12 )
TEXT 1496 -328 Left 2 ;7:2
TEXT 1448 -168 Left 2 !K1 L23 L24 0.95
TEXT 888 -568 Left 2 !.meas reQ9 AVG (V(Q1B)-V(Q1E))/Ic(Q9)
TEXT 3472 -712 Left 2 !.meas reQ10 AVG (V(Q10B)-V(Q10E))/Ic(Q8)
TEXT 4376 -504 Left 2 ;2:1
TEXT 4320 -344 Left 2 !K2 L25 L26 0.8
TEXT 2080 -112 Left 2 !.meas reQ11 AVG (V(Q11B)-V(Q11E))/Ic(Q11)
TEXT 1192 -24 Left 2 !.param beta=200
TEXT 2680 -48 Left 2 !.meas reQ12 AVG (V(Q12B)-V(Q12E))/Ic(Q12)
TEXT 1216 264 Left 2 !* Q2SCR562F3 NPN BJT model\n* PKG: HUML2020L3,Vceo=30V,Ic=6A\n* Model Generated by ROHM\n* All Rights Reserved\n* Commercial Use or\n* Resale Restricted\n* Date: 2016/05/09\n.MODEL Q2SCR562F3 NPN\n+ IS=2.7000E-12\n+ BF=359.65\n+ VAF=47.246\n+ IKF=17.794\n+ ISE=5.1063E-12\n+ NE=1.6800\n+ BR=164.76\n+ VAR=13.821\n+ IKR=10.533\n+ ISC=5.5359E-12\n+ NC=2.3044\n+ NK=.54944\n+ RE=2.0000E-3\n+ RB=2.3516\n+ RC=35.434E-3\n+ CJE=711.58E-12\n+ VJE=.77165\n+ MJE=.37592\n+ CJC=152.75E-12\n+ VJC=.55108\n+ MJC=.39358\n+ TF=359.46E-12\n+ XTF=415.35\n+ VTF=248.34\n+ ITF=34.139\n+ TR=7.0435E-9\n+ XTB=1.5000\n+ TRE1=0.05
TEXT 3048 -376 Left 2 ;11:2
TEXT 3000 -216 Left 2 !K3 L30 L31 0.95
TEXT 3264 -56 Left 2 !.meas reQ13 AVG (V(Q13B)-V(Q13E))/Ic(Q13)

ad9850.asc, the sub-circuit schematic file:
Version 4
SHEET 1 1172 680
WIRE 192 -16 176 -16
WIRE 288 -16 256 -16
WIRE 304 -16 288 -16
WIRE 400 -16 368 -16
WIRE 416 -16 400 -16
WIRE 496 -16 480 -16
WIRE -96 80 -208 80
WIRE -32 80 -96 80
WIRE 32 80 -32 80
WIRE 96 80 32 80
WIRE 176 80 176 -16
WIRE 176 80 96 80
WIRE 192 80 176 80
WIRE 288 80 288 -16
WIRE 288 80 272 80
WIRE 304 80 288 80
WIRE 400 80 400 -16
WIRE 400 80 384 80
WIRE 496 80 496 -16
WIRE 496 80 480 80
WIRE 576 80 496 80
WIRE 656 80 576 80
WIRE 672 80 656 80
WIRE -208 96 -208 80
WIRE 32 96 32 80
WIRE 96 96 96 80
WIRE 176 96 176 80
WIRE 288 96 288 80
WIRE 400 96 400 80
WIRE 496 96 496 80
WIRE -32 144 -32 80
WIRE -96 160 -96 80
WIRE 720 160 656 160
WIRE -208 176 -208 160
WIRE -32 176 -32 144
WIRE 32 208 32 160
WIRE 688 240 656 240
WIRE 720 240 720 224
WIRE 720 240 688 240
WIRE 352 272 288 272
WIRE 416 272 352 272
WIRE 528 272 416 272
WIRE 416 288 416 272
WIRE -96 320 -96 224
WIRE -32 320 -32 256
WIRE -32 320 -96 320
WIRE 32 320 32 288
WIRE 32 320 -32 320
WIRE 528 352 528 272
WIRE -32 368 -32 320
WIRE 352 368 352 272
WIRE 688 368 688 240
WIRE 416 400 416 352
WIRE 288 432 288 272
WIRE 288 512 288 496
WIRE 352 512 352 448
WIRE 352 512 288 512
WIRE 416 512 416 480
WIRE 416 512 352 512
WIRE 528 512 528 432
WIRE 528 512 416 512
WIRE 352 560 352 512
FLAG -32 368 0
FLAG 96 176 0
FLAG 176 160 0
FLAG 288 160 0
FLAG 400 160 0
FLAG 496 160 0
FLAG 576 160 0
FLAG 672 80 sine_out
IOPIN 672 80 Out
FLAG -208 176 0
FLAG 688 368 0
FLAG 352 560 0
FLAG 528 272 comp
IOPIN 528 272 Out
FLAG -32 144 reg
SYMBOL current -32 176 R0
WINDOW 3 -190 -126 Left 2
WINDOW 123 0 0 Left 0
WINDOW 39 24 28 Left 2
SYMATTR Value SINE(-10.24m 10.24m {FREQ} 0 0 0)
SYMATTR InstName I1
SYMBOL res 80 80 R0
SYMATTR InstName R1
SYMATTR Value 200
SYMBOL res 560 64 R0
SYMATTR InstName R2
SYMATTR Value 200
SYMBOL cap 160 96 R0
SYMATTR InstName C1
SYMATTR Value 22p
SYMBOL cap 272 96 R0
SYMATTR InstName C2
SYMATTR Value 33p
SYMBOL cap 384 96 R0
SYMATTR InstName C3
SYMATTR Value 22p
SYMBOL cap 480 96 R0
WINDOW 3 23 56 Left 2
SYMATTR Value 22p
SYMATTR InstName C4
SYMBOL ind 288 96 M270
WINDOW 0 53 62 VTop 2
WINDOW 3 57 59 VBottom 2
SYMATTR InstName L1
SYMATTR Value 470n
SYMBOL ind 400 96 M270
WINDOW 0 57 54 VTop 2
WINDOW 3 56 54 VBottom 2
SYMATTR InstName L2
SYMATTR Value 390n
SYMBOL ind 496 96 M270
WINDOW 0 52 52 VTop 2
WINDOW 3 51 45 VBottom 2
SYMATTR InstName L3
SYMATTR Value 390n
SYMBOL cap 256 -32 R90
WINDOW 0 -31 30 VBottom 2
WINDOW 3 -26 28 VTop 2
SYMATTR InstName C5
SYMATTR Value 1p
SYMBOL cap 368 -32 R90
WINDOW 0 -23 26 VBottom 2
WINDOW 3 -22 28 VTop 2
SYMATTR InstName C6
SYMATTR Value 5.6p
SYMBOL cap 480 -32 R90
WINDOW 0 -33 31 VBottom 2
WINDOW 3 -29 31 VTop 2
SYMATTR InstName C7
SYMATTR Value 4.7p
SYMBOL cap -224 96 R0
SYMATTR InstName C8
SYMATTR Value 8p
SYMBOL diode 16 96 R0
SYMATTR InstName D1
SYMBOL diode -80 224 R180
WINDOW 0 24 64 Left 2
WINDOW 3 24 0 Left 2
SYMATTR InstName D2
SYMBOL voltage 32 192 R0
WINDOW 123 0 0 Left 0
WINDOW 39 0 0 Left 0
SYMATTR InstName V2
SYMATTR Value 1.5
SYMBOL res 640 64 R0
SYMATTR InstName R3
SYMATTR Value 1K
SYMBOL res 672 256 R180
WINDOW 0 36 76 Left 2
WINDOW 3 36 40 Left 2
SYMATTR InstName R4
SYMATTR Value 500K
SYMBOL cap 704 160 R0
SYMATTR InstName C9
SYMATTR Value 3p
SYMBOL current 352 368 R0
WINDOW 3 -190 -126 Left 2
WINDOW 123 0 0 Left 0
WINDOW 39 24 28 Left 2
SYMATTR Value SINE(-10.24m 10.24m {FREQ} {1/FREQ/2} 0 0)
SYMATTR InstName I2
SYMBOL diode 400 288 R0
SYMATTR InstName D3
SYMBOL diode 304 496 R180
WINDOW 0 24 64 Left 2
WINDOW 3 24 0 Left 2
SYMATTR InstName D4
SYMBOL voltage 416 384 R0
WINDOW 123 0 0 Left 0
WINDOW 39 0 0 Left 0
SYMATTR InstName V4
SYMATTR Value 1.5
SYMBOL res 512 336 R0
SYMATTR InstName R5
SYMATTR Value 100

mixer.asc, the sub-circuit schematic file:
Version 4
SHEET 1 1072 680
WIRE 256 32 128 32
WIRE 128 48 128 32
WIRE 416 48 320 48
WIRE 256 80 256 32
WIRE 320 80 320 48
WIRE 192 176 192 80
WIRE 320 176 320 80
WIRE 192 208 192 176
WIRE 416 208 192 208
WIRE 16 224 16 208
WIRE 128 224 128 208
WIRE 256 224 256 176
WIRE 256 224 128 224
FLAG 416 128 RF
IOPIN 416 128 BiDir
FLAG 16 48 LO
IOPIN 16 48 In
FLAG 528 48 IF
IOPIN 528 48 BiDir
FLAG 528 208 0
FLAG 16 224 0
FLAG 128 128 0
SYMBOL ind2 0 112 R0
WINDOW 3 -49 67 Left 2
SYMATTR Value 50n
SYMATTR InstName L1
SYMATTR Type ind
SYMBOL ind2 0 32 R0
WINDOW 3 -46 82 Left 2
SYMATTR Value 50n
SYMATTR InstName L2
SYMATTR Type ind
SYMBOL ind2 144 144 R180
WINDOW 0 36 80 Left 2
WINDOW 3 36 40 Left 2
SYMATTR InstName L3
SYMATTR Value 50n
SYMATTR Type ind
SYMBOL ind2 144 224 R180
WINDOW 0 36 80 Left 2
WINDOW 3 36 40 Left 2
SYMATTR InstName L4
SYMATTR Value 50n
SYMATTR Type ind
SYMBOL ind2 544 144 R180
WINDOW 0 36 80 Left 2
WINDOW 3 -50 50 Left 2
SYMATTR InstName L5
SYMATTR Value 50n
SYMATTR Type ind
SYMBOL ind2 544 224 R180
WINDOW 0 36 80 Left 2
WINDOW 3 -54 55 Left 2
SYMATTR InstName L6
SYMATTR Value 50n
SYMATTR Type ind
SYMBOL ind2 400 32 R0
SYMATTR InstName L7
SYMATTR Value 50n
SYMATTR Type ind
SYMBOL ind2 400 112 R0
WINDOW 3 35 87 Left 2
SYMATTR Value 50n
SYMATTR InstName L8
SYMATTR Type ind
SYMBOL schottky 192 96 R270
WINDOW 0 32 32 VTop 2
WINDOW 3 0 32 VBottom 2
SYMATTR InstName D1
SYMATTR Value PMEG2010AEB
SYMATTR Description Diode
SYMATTR Type diode
SYMBOL schottky 256 96 R270
WINDOW 0 32 32 VTop 2
WINDOW 3 0 32 VBottom 2
SYMATTR InstName D2
SYMATTR Value PMEG2010AEB
SYMATTR Description Diode
SYMATTR Type diode
SYMBOL schottky 320 160 R90
WINDOW 0 0 32 VBottom 2
WINDOW 3 32 32 VTop 2
SYMATTR InstName D3
SYMATTR Value PMEG2010AEB
SYMATTR Description Diode
SYMATTR Type diode
SYMBOL schottky 256 160 R90
WINDOW 0 0 32 VBottom 2
WINDOW 3 32 32 VTop 2
SYMATTR InstName D4
SYMATTR Value PMEG2010AEB
SYMATTR Description Diode
SYMATTR Type diode
TEXT -56 264 Left 2 !K1 L1 L2 L3 L4 0.95
TEXT 352 272 Left 2 !K2 L5 L6 L7 L8 0.95

The netlist it stands for:
* Draft1_old.asc
XU1 NC_01 N049 ad9850 params: FREQ=19.39Meg
C1 N049 0 22p
C2 N050 0 33p
C3 N051 0 22p
C4 N052 0 22p
L1 N050 N049 470n
L2 N051 N050 390n
L3 N052 N051 390n
C5 N050 N049 1p
C6 N051 N050 5.6p
C7 N052 N051 4.7p
L8 N052 N053 122n
C12 0 N052 1514p
L9 N053 N054 126n
C13 N053 0 1902p
V5 P001 0 PULSE(0.3 3.1 0 325p 225p {1/125Meg/2} {1/125Meg})
Q4 N036 N043 N045 0 my2N2222
R18 N036 N020 150
V6 N011 0 5
C23 N043 N042 2.5n
R15 N043 0 1.2k
R17 N011 N043 2k
C25 N045 P002 100p
R12 P002 0 10
R21 P001 N042 150
C24 P003 N036 2.5n Rser={C_RES}
R22 N045 0 100
L18 P003 P004 33n
L19 P004 P005 123n
C31 0 P004 36p Rser={C_RES}
C32 P005 0 47p Rser={C_RES}
L6 N054 N027 122n
C10 N054 0 1902p
C28 N027 0 1513p
XX1 N029 N027 N039 mixer
L4 P005 N037 90n
C8 0 N037 13p Rser={C_RES}
Q1 N028 N038 N044 0 my2N2222
C9 N038 N037 2.5n Rser={C_RES}
R3 N028 N019 30
R4 N011 N038 1.2k
R5 N038 0 1.2k
R2 N044 0 47
Q2 N012 N016 N017 0 my2N2222
R7 N012 N010 1.5k
R8 N010 N016 150
R9 N016 0 120
C14 N044 0 2.5n
C11 N029 N028 2.5n
C29 N016 0 2.5n
C33 N017 0 1n
R20 N017 0 1k
Q5 N057 N058 N059 0 2N2222
C34 N058 NC_02 2.5n
R6 N057 N055 100
R19 N055 N058 1.2k
R24 N058 0 910
R25 N059 0 47
C35 N059 0 2.5n
C36 NC_03 N057 2.5n
Q6 N013 N012 N018 0 my2N2222
C39 N018 0 1n
R1 N018 0 100
R26 N010 N013 150
C40 NC_04 N013 2.5n
L21 N011 N020 10µ
L22 N011 N019 10µ
Q3 N003 N006 N008 0 DI_MMBTH10
R11 0 P006 150
R13 0 N006 510
R14 N006 0 470
C16 N004 N003 2.5n
L5 P006 N003 10µ
C17 N032 0 360p
C18 N033 N032 62p
L7 N032 N033 18n
L10 N032 0 3.3n
C19 N034 N033 68p
L11 N033 N034 20n
C20 N034 0 910p
L12 N034 0 1.3n
C21 P007 N034 1.2p
L13 P007 N035 1µ
C22 N006 0 2.5n
C15 N008 P008 2.5n
R10 N008 0 100
R16 P008 0 47
C26 N004 0 750p
L14 N004 0 1.6n
Q7 N001 N005 N007 0 DI_MMBTH10
R28 0 N005 470
R29 N005 0 510
C27 N002 N001 2.5n
C30 N007 P009 2.5n
R30 N007 0 100
R34 P009 0 47
C37 N005 N004 2.5n
C38 N002 0 750p
L16 N002 0 1.6n
R35 0 N001 50
R38 N019 N011 20
R39 N044 0 47
Q9 N030 Q1B Q1E 0 DI_MMBTH10
R41 N011 P010 50
R42 N011 Q1B 470
R43 Q1E 0 68
C42 Q1E 0 1n
C43 N031 N030 2.5n
C47 Q1B N039 2.5n
L15 P010 N030 0.1µ
R44 Q1B 0 510
L17 N011 N030 4.7µ
L23 N031 0 0.021m
L24 0 N032 0.002m
C49 N048 NC_05 2.5n
V1 N009 0 12
R50 NC_06 0 180
Q8 N046 P011 N056 0 DI_MMBTH10
L20 N041 N046 10µ
R23 N040 N041 30
C41 N041 0 1µf
C44 N047 N046 2.5n
R27 N047 0 100
R31 N056 0 100
C45 N056 0 1n
Q10 N046 Q10B Q10E 0 DI_MMBTH10
R32 Q10E 0 100
C46 Q10E 0 1n
R33 P011 N048 15
R36 N048 Q10B 15
R37 N040 N048 1k
R40 N048 0 1k
L25 NC_07 0 2.94m
L26 0 NC_08 0.840m
R46 NC_09 0 120
Q11 N021 Q11B Q11E 0 DI_MMBTH10
R47 Q11E 0 120
C48 Q11E 0 1n
R51 Q11B 0 1.2k
R49 N011 Q11B 750
L27 N014 N021 4.7µ
R48 N014 N009 120
C50 Q12B N021 2.5n
C51 Q11B N035 2.5n
C52 N009 N014 1µ
R45 NC_10 0 150
Q12 N022 Q12B Q12E 0 DI_MMBTH10
R52 Q12E 0 100
C53 Q12E P012 1n
R53 Q12B 0 470
R54 N009 Q12B 470
L28 N015 N022 0.1µ
R55 N015 N009 47
C54 N023 N022 2.5n
C55 N009 P013 1µ
R56 NC_11 0 110
R57 P012 0 30
R58 P013 N015 30
V2 test 0 AC 1
Q13 N025 Q13B Q13E 0 Q2SCR562F3
R61 N009 Q13B 750
C57 N026 N025 2.5n
R63 N026 0 24
L30 N023 0 0.051m
L31 0 N024 0.002m
R59 NC_12 0 15
C56 Q13E 0 1n
R64 N009 N025 150
C58 Q13B N024 2.5n
R60 Q13B 0 470

* block symbol definitions
.subckt ad9850 sine_out comp
I1 reg 0 SINE(-10.24m 10.24m {FREQ} 0 0 0)
R1 reg 0 200
R2 sine_out 0 200
C1 reg 0 22p
C2 N001 0 33p
C3 N002 0 22p
C4 sine_out 0 22p
L1 N001 reg 470n
L2 N002 N001 390n
L3 sine_out N002 390n
C5 N001 reg 1p
C6 N002 N001 5.6p
C7 sine_out N002 4.7p
C8 reg 0 8p
D1 reg N004 D
D2 0 reg D
V2 N004 0 1.5
R3 sine_out N003 1K
R4 0 N003 500K
C9 N003 0 3p
I2 comp 0 SINE(-10.24m 10.24m {FREQ} {1/FREQ/2} 0 0)
D3 comp N005 D
D4 0 comp D
V4 N005 0 1.5
R5 comp 0 100
.ends ad9850

.subckt mixer LO IF RF
L1 P001 0 50n
L2 LO P001 50n
L3 0 N001 50n
L4 N004 0 50n
L5 P002 IF 50n
L6 0 P002 50n
L7 N002 RF 50n
L8 RF N003 50n
D1 N003 N001 PMEG2010AEB
D2 N001 N002 PMEG2010AEB
D3 N002 N004 PMEG2010AEB
D4 N004 N003 PMEG2010AEB
K1 L1 L2 L3 L4 0.95
K2 L5 L6 L7 L8 0.95
.ends mixer

.model D D
.lib standard.dio
.model NPN NPN
.model PNP PNP
.lib standard.bjt
.tran 0 5u 0 0.0000000001
* LP filter
.model idealDiode D(Ron=0 Roff=100Meg Vfwd=0)
.param c_res=0.01
* LP filter
.model my2N2222 NPN(IS=1E-14 VAF=100 BF={beta} IKF=0.3 XTB=1.5 BR=3 CJC=8E-12 CJE=25E-12 TR=100E-9 TF=400E-12 ITF=1 VTF=2 XTF=3 RB=10 RC=.3 RE=.2 Vceo=30 Icrating=800m mfg=NXP)
* .step param beta 120 300 175
.MODEL DI_MMBTH10  NPN (IS=1.26e-016 NF=1.00 BF={beta} VAF=114
+ IKF=24.3m ISE=1.28p NE=2.00 BR=4.00 NR=1.00
+ VAR=16.0 IKR=60.0m RE=1.51 RB=6.05 RC=0.605
+ XTB=1.5 CJE=6.27p VJE=1.10 MJE=0.500 CJC=2.02p VJC=0.300
+ MJC=0.300 TF=130p TR=27.4n EG=1.12 )
* 7:2
K1 L23 L24 0.95
.meas reQ9 AVG (V(Q1B)-V(Q1E))/Ic(Q9)
.meas reQ10 AVG (V(Q10B)-V(Q10E))/Ic(Q8)
* 2:1
K2 L25 L26 0.8
.meas reQ11 AVG (V(Q11B)-V(Q11E))/Ic(Q11)
.param beta=200
.meas reQ12 AVG (V(Q12B)-V(Q12E))/Ic(Q12)
* Q2SCR562F3 NPN BJT model
* PKG: HUML2020L3,Vceo=30V,Ic=6A
* Model Generated by ROHM
* All Rights Reserved
* Commercial Use or
* Resale Restricted
* Date: 2016/05/09
.MODEL Q2SCR562F3 NPN
+ IS=2.7000E-12
+ BF=359.65
+ VAF=47.246
+ IKF=17.794
+ ISE=5.1063E-12
+ NE=1.6800
+ BR=164.76
+ VAR=13.821
+ IKR=10.533
+ ISC=5.5359E-12
+ NC=2.3044
+ NK=.54944
+ RE=2.0000E-3
+ RB=2.3516
+ RC=35.434E-3
+ CJE=711.58E-12
+ VJE=.77165
+ MJE=.37592
+ CJC=152.75E-12
+ VJC=.55108
+ MJC=.39358
+ TF=359.46E-12
+ XTF=415.35
+ VTF=248.34
+ ITF=34.139
+ TR=7.0435E-9
+ XTB=1.5000
+ TRE1=0.05
* 11:2
K3 L30 L31 0.95
.meas reQ13 AVG (V(Q13B)-V(Q13E))/Ic(Q13)
.backanno
.end